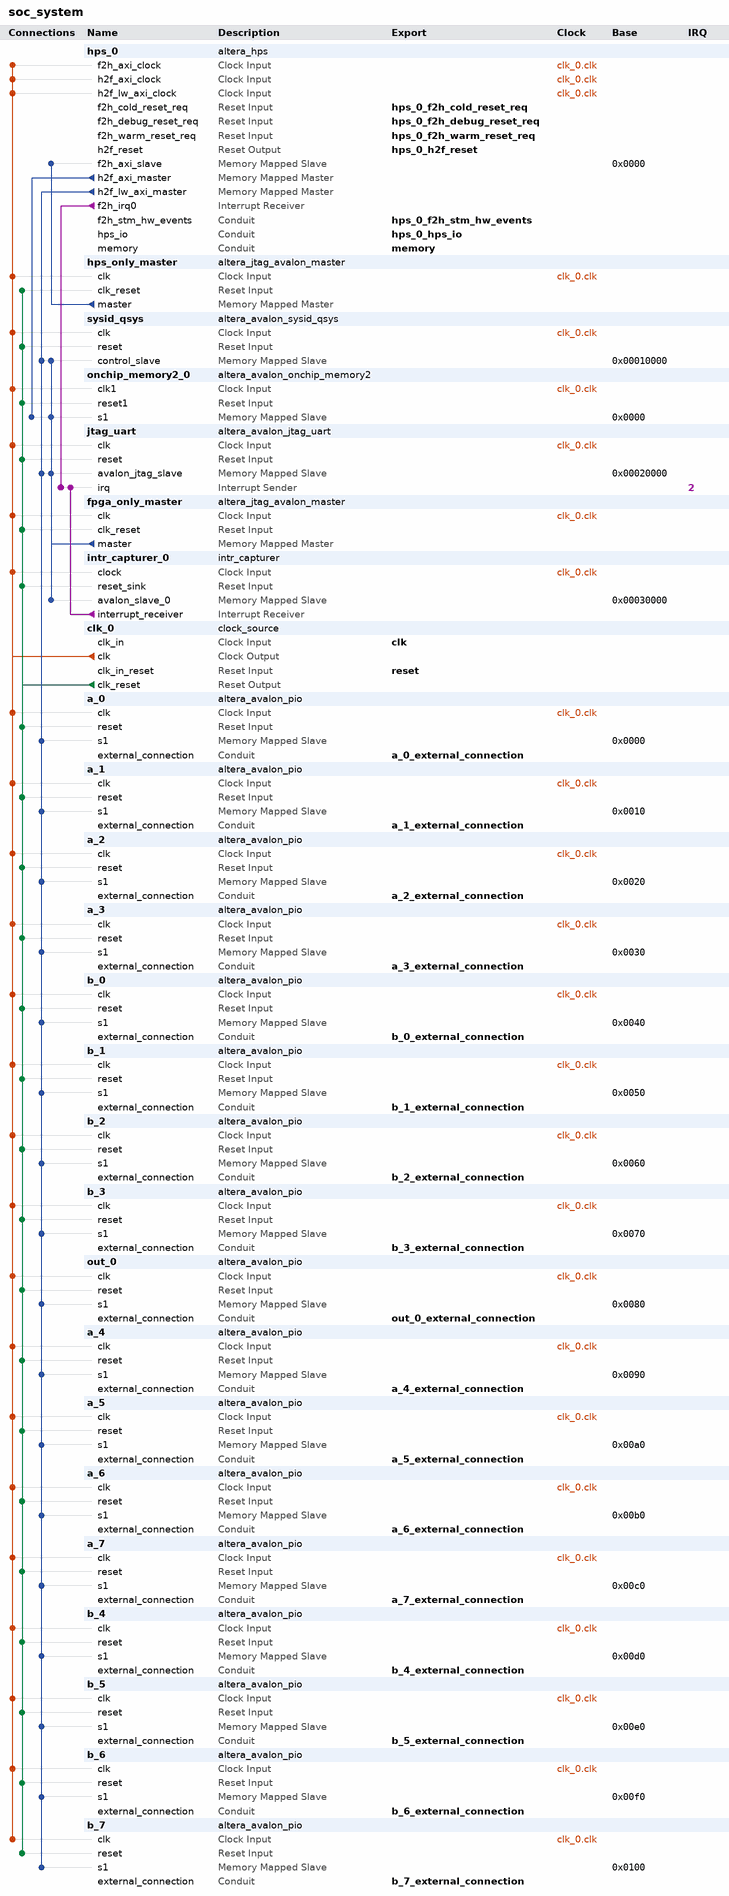
[diagram p0: system contents]
# Platform Designer (Qsys) system soc_system, Cyclone V 5CSEMA5F31C6
# Parameters at their usual value, and those the tool derives, are not listed.
package require -exact qsys 16.1
create_system soc_system
set_project_property DEVICE_FAMILY {Cyclone V}
set_project_property DEVICE 5CSEMA5F31C6

add_instance hps_0 altera_hps 16.1
set_instance_parameter_value hps_0 EMAC1_Mode RGMII
set_instance_parameter_value hps_0 EMAC1_PinMuxing {HPS I/O Set 0}
set_instance_parameter_value hps_0 F2SCLK_COLDRST_Enable true
set_instance_parameter_value hps_0 F2SCLK_DBGRST_Enable true
set_instance_parameter_value hps_0 F2SCLK_WARMRST_Enable true
set_instance_parameter_value hps_0 F2SINTERRUPT_Enable true
set_instance_parameter_value hps_0 F2S_Width 2
set_instance_parameter_value hps_0 FPGA_PERIPHERAL_OUTPUT_CLOCK_FREQ_EMAC0_GTX_CLK 100
set_instance_parameter_value hps_0 FPGA_PERIPHERAL_OUTPUT_CLOCK_FREQ_EMAC0_MD_CLK 100.0
set_instance_parameter_value hps_0 FPGA_PERIPHERAL_OUTPUT_CLOCK_FREQ_EMAC1_GTX_CLK 100
set_instance_parameter_value hps_0 FPGA_PERIPHERAL_OUTPUT_CLOCK_FREQ_EMAC1_MD_CLK 100.0
set_instance_parameter_value hps_0 HPS_PROTOCOL DDR3
set_instance_parameter_value hps_0 I2C0_Mode I2C
set_instance_parameter_value hps_0 I2C0_PinMuxing {HPS I/O Set 0}
set_instance_parameter_value hps_0 I2C1_Mode I2C
set_instance_parameter_value hps_0 I2C1_PinMuxing {HPS I/O Set 0}
set_instance_parameter_value hps_0 LWH2F_Enable true
set_instance_parameter_value hps_0 MEM_BANKADDR_WIDTH 3
set_instance_parameter_value hps_0 MEM_CLK_FREQ 400.0
set_instance_parameter_value hps_0 MEM_COL_ADDR_WIDTH 10
set_instance_parameter_value hps_0 MEM_DQ_WIDTH 32
set_instance_parameter_value hps_0 MEM_DRV_STR RZQ/7
set_instance_parameter_value hps_0 MEM_ROW_ADDR_WIDTH 15
set_instance_parameter_value hps_0 MEM_RTT_NOM RZQ/4
set_instance_parameter_value hps_0 MEM_RTT_WR RZQ/4
set_instance_parameter_value hps_0 MEM_TCL 11
set_instance_parameter_value hps_0 MEM_TFAW_NS 30.0
set_instance_parameter_value hps_0 MEM_TRAS_NS 35.0
set_instance_parameter_value hps_0 MEM_TRCD_NS 13.75
set_instance_parameter_value hps_0 MEM_TRFC_NS 260.0
set_instance_parameter_value hps_0 MEM_TRP_NS 13.75
set_instance_parameter_value hps_0 MEM_VENDOR JEDEC
set_instance_parameter_value hps_0 MEM_WTCL 8
set_instance_parameter_value hps_0 QSPI_Mode {1 SS}
set_instance_parameter_value hps_0 QSPI_PinMuxing {HPS I/O Set 0}
set_instance_parameter_value hps_0 REF_CLK_FREQ 25.0
set_instance_parameter_value hps_0 S2FCLK_USER2CLK 5
set_instance_parameter_value hps_0 S2F_Width 2
set_instance_parameter_value hps_0 SDIO_Mode {4-bit Data}
set_instance_parameter_value hps_0 SDIO_PinMuxing {HPS I/O Set 0}
set_instance_parameter_value hps_0 SPIM1_Mode {Single Slave Select}
set_instance_parameter_value hps_0 SPIM1_PinMuxing {HPS I/O Set 0}
set_instance_parameter_value hps_0 STM_Enable true
set_instance_parameter_value hps_0 TIMING_BOARD_AC_SKEW 0.03
set_instance_parameter_value hps_0 TIMING_BOARD_AC_TO_CK_SKEW 0.0
set_instance_parameter_value hps_0 TIMING_BOARD_DQ_TO_DQS_SKEW 0.0
set_instance_parameter_value hps_0 TIMING_BOARD_MAX_CK_DELAY 0.03
set_instance_parameter_value hps_0 TIMING_BOARD_MAX_DQS_DELAY 0.02
set_instance_parameter_value hps_0 TIMING_BOARD_SKEW_BETWEEN_DQS 0.08
set_instance_parameter_value hps_0 TIMING_BOARD_SKEW_CKDQS_DIMM_MAX 0.16
set_instance_parameter_value hps_0 TIMING_BOARD_SKEW_CKDQS_DIMM_MIN 0.09
set_instance_parameter_value hps_0 TIMING_BOARD_SKEW_WITHIN_DQS 0.01
set_instance_parameter_value hps_0 TIMING_TDH 65
set_instance_parameter_value hps_0 TIMING_TDQSCK 255
set_instance_parameter_value hps_0 TIMING_TDQSQ 125
set_instance_parameter_value hps_0 TIMING_TDS 30
set_instance_parameter_value hps_0 TIMING_TIH 140
set_instance_parameter_value hps_0 TIMING_TIS 180
set_instance_parameter_value hps_0 TIMING_TQSH 0.4
set_instance_parameter_value hps_0 UART0_Mode {No Flow Control}
set_instance_parameter_value hps_0 UART0_PinMuxing {HPS I/O Set 0}
set_instance_parameter_value hps_0 USB1_Mode SDR
set_instance_parameter_value hps_0 USB1_PinMuxing {HPS I/O Set 0}
set_instance_parameter_value hps_0 desired_cfg_clk_mhz 100.0
set_instance_parameter_value hps_0 desired_qspi_clk_mhz 400.0

add_instance hps_only_master altera_jtag_avalon_master 16.1

add_instance sysid_qsys altera_avalon_sysid_qsys 16.1
set_instance_parameter_value sysid_qsys id -1395322110

add_instance onchip_memory2_0 altera_avalon_onchip_memory2 16.1
set_instance_parameter_value onchip_memory2_0 dataWidth 64
set_instance_parameter_value onchip_memory2_0 dualPort false
set_instance_parameter_value onchip_memory2_0 initMemContent true
set_instance_parameter_value onchip_memory2_0 initializationFileName onchip_memory2_0
set_instance_parameter_value onchip_memory2_0 memorySize 65536

add_instance jtag_uart altera_avalon_jtag_uart 16.1
set_instance_parameter_value jtag_uart allowMultipleConnections true
set_instance_parameter_value jtag_uart simInteractiveOptions INTERACTIVE_ASCII_OUTPUT

add_instance fpga_only_master altera_jtag_avalon_master 16.1

add_instance intr_capturer_0 intr_capturer 100.99.98.97

add_instance clk_0 clock_source 16.1
set_instance_parameter_value clk_0 clockFrequency 50000000

add_instance a_0 altera_avalon_pio 16.1
set_instance_parameter_value a_0 direction Output
set_instance_parameter_value a_0 resetValue 255
set_instance_parameter_value a_0 width 8

add_instance a_1 altera_avalon_pio 16.1
set_instance_parameter_value a_1 direction Output
set_instance_parameter_value a_1 resetValue 255
set_instance_parameter_value a_1 width 8

add_instance a_2 altera_avalon_pio 16.1
set_instance_parameter_value a_2 direction Output
set_instance_parameter_value a_2 resetValue 255
set_instance_parameter_value a_2 width 8

add_instance a_3 altera_avalon_pio 16.1
set_instance_parameter_value a_3 direction Output
set_instance_parameter_value a_3 resetValue 255
set_instance_parameter_value a_3 width 8

add_instance b_0 altera_avalon_pio 16.1
set_instance_parameter_value b_0 direction Output
set_instance_parameter_value b_0 resetValue 255
set_instance_parameter_value b_0 width 8

add_instance b_1 altera_avalon_pio 16.1
set_instance_parameter_value b_1 direction Output
set_instance_parameter_value b_1 resetValue 255
set_instance_parameter_value b_1 width 8

add_instance b_2 altera_avalon_pio 16.1
set_instance_parameter_value b_2 direction Output
set_instance_parameter_value b_2 resetValue 255
set_instance_parameter_value b_2 width 8

add_instance b_3 altera_avalon_pio 16.1
set_instance_parameter_value b_3 direction Output
set_instance_parameter_value b_3 resetValue 255
set_instance_parameter_value b_3 width 8

add_instance out_0 altera_avalon_pio 16.1
set_instance_parameter_value out_0 direction Input
set_instance_parameter_value out_0 width 32

add_instance a_4 altera_avalon_pio 16.1
set_instance_parameter_value a_4 direction Output
set_instance_parameter_value a_4 resetValue 255
set_instance_parameter_value a_4 width 8

add_instance a_5 altera_avalon_pio 16.1
set_instance_parameter_value a_5 direction Output
set_instance_parameter_value a_5 resetValue 255
set_instance_parameter_value a_5 width 8

add_instance a_6 altera_avalon_pio 16.1
set_instance_parameter_value a_6 direction Output
set_instance_parameter_value a_6 resetValue 255
set_instance_parameter_value a_6 width 8

add_instance a_7 altera_avalon_pio 16.1
set_instance_parameter_value a_7 direction Output
set_instance_parameter_value a_7 resetValue 255
set_instance_parameter_value a_7 width 8

add_instance b_4 altera_avalon_pio 16.1
set_instance_parameter_value b_4 direction Output
set_instance_parameter_value b_4 resetValue 255
set_instance_parameter_value b_4 width 8

add_instance b_5 altera_avalon_pio 16.1
set_instance_parameter_value b_5 direction Output
set_instance_parameter_value b_5 resetValue 255
set_instance_parameter_value b_5 width 8

add_instance b_6 altera_avalon_pio 16.1
set_instance_parameter_value b_6 direction Output
set_instance_parameter_value b_6 resetValue 255
set_instance_parameter_value b_6 width 8

add_instance b_7 altera_avalon_pio 16.1
set_instance_parameter_value b_7 direction Output
set_instance_parameter_value b_7 resetValue 255
set_instance_parameter_value b_7 width 8

# connections
add_connection clk_0.clk a_0.clk clock
add_connection clk_0.clk a_1.clk clock
add_connection clk_0.clk a_2.clk clock
add_connection clk_0.clk a_3.clk clock
add_connection clk_0.clk a_4.clk clock
add_connection clk_0.clk a_5.clk clock
add_connection clk_0.clk a_6.clk clock
add_connection clk_0.clk a_7.clk clock
add_connection clk_0.clk b_0.clk clock
add_connection clk_0.clk b_1.clk clock
add_connection clk_0.clk b_2.clk clock
add_connection clk_0.clk b_3.clk clock
add_connection clk_0.clk b_4.clk clock
add_connection clk_0.clk b_5.clk clock
add_connection clk_0.clk b_6.clk clock
add_connection clk_0.clk b_7.clk clock
add_connection clk_0.clk fpga_only_master.clk clock
add_connection clk_0.clk hps_0.f2h_axi_clock clock
add_connection clk_0.clk hps_0.h2f_axi_clock clock
add_connection clk_0.clk hps_0.h2f_lw_axi_clock clock
add_connection clk_0.clk hps_only_master.clk clock
add_connection clk_0.clk intr_capturer_0.clock clock
add_connection clk_0.clk jtag_uart.clk clock
add_connection clk_0.clk onchip_memory2_0.clk1 clock
add_connection clk_0.clk out_0.clk clock
add_connection clk_0.clk sysid_qsys.clk clock
add_connection clk_0.clk_reset a_0.reset reset
add_connection clk_0.clk_reset a_1.reset reset
add_connection clk_0.clk_reset a_2.reset reset
add_connection clk_0.clk_reset a_3.reset reset
add_connection clk_0.clk_reset a_4.reset reset
add_connection clk_0.clk_reset a_5.reset reset
add_connection clk_0.clk_reset a_6.reset reset
add_connection clk_0.clk_reset a_7.reset reset
add_connection clk_0.clk_reset b_0.reset reset
add_connection clk_0.clk_reset b_1.reset reset
add_connection clk_0.clk_reset b_2.reset reset
add_connection clk_0.clk_reset b_3.reset reset
add_connection clk_0.clk_reset b_4.reset reset
add_connection clk_0.clk_reset b_5.reset reset
add_connection clk_0.clk_reset b_6.reset reset
add_connection clk_0.clk_reset b_7.reset reset
add_connection clk_0.clk_reset fpga_only_master.clk_reset reset
add_connection clk_0.clk_reset hps_only_master.clk_reset reset
add_connection clk_0.clk_reset intr_capturer_0.reset_sink reset
add_connection clk_0.clk_reset jtag_uart.reset reset
add_connection clk_0.clk_reset onchip_memory2_0.reset1 reset
add_connection clk_0.clk_reset out_0.reset reset
add_connection clk_0.clk_reset sysid_qsys.reset reset
add_connection fpga_only_master.master intr_capturer_0.avalon_slave_0 avalon
set_connection_parameter_value fpga_only_master.master/intr_capturer_0.avalon_slave_0 baseAddress 0x00030000
add_connection fpga_only_master.master jtag_uart.avalon_jtag_slave avalon
set_connection_parameter_value fpga_only_master.master/jtag_uart.avalon_jtag_slave baseAddress 0x00020000
add_connection fpga_only_master.master onchip_memory2_0.s1 avalon
set_connection_parameter_value fpga_only_master.master/onchip_memory2_0.s1 baseAddress 0x0000
add_connection fpga_only_master.master sysid_qsys.control_slave avalon
set_connection_parameter_value fpga_only_master.master/sysid_qsys.control_slave baseAddress 0x00010000
add_connection hps_0.h2f_axi_master onchip_memory2_0.s1 avalon
set_connection_parameter_value hps_0.h2f_axi_master/onchip_memory2_0.s1 baseAddress 0x0000
add_connection hps_0.h2f_lw_axi_master a_0.s1 avalon
set_connection_parameter_value hps_0.h2f_lw_axi_master/a_0.s1 baseAddress 0x0000
add_connection hps_0.h2f_lw_axi_master a_1.s1 avalon
set_connection_parameter_value hps_0.h2f_lw_axi_master/a_1.s1 baseAddress 0x0010
add_connection hps_0.h2f_lw_axi_master a_2.s1 avalon
set_connection_parameter_value hps_0.h2f_lw_axi_master/a_2.s1 baseAddress 0x0020
add_connection hps_0.h2f_lw_axi_master a_3.s1 avalon
set_connection_parameter_value hps_0.h2f_lw_axi_master/a_3.s1 baseAddress 0x0030
add_connection hps_0.h2f_lw_axi_master a_4.s1 avalon
set_connection_parameter_value hps_0.h2f_lw_axi_master/a_4.s1 baseAddress 0x0090
add_connection hps_0.h2f_lw_axi_master a_5.s1 avalon
set_connection_parameter_value hps_0.h2f_lw_axi_master/a_5.s1 baseAddress 0x00a0
add_connection hps_0.h2f_lw_axi_master a_6.s1 avalon
set_connection_parameter_value hps_0.h2f_lw_axi_master/a_6.s1 baseAddress 0x00b0
add_connection hps_0.h2f_lw_axi_master a_7.s1 avalon
set_connection_parameter_value hps_0.h2f_lw_axi_master/a_7.s1 baseAddress 0x00c0
add_connection hps_0.h2f_lw_axi_master b_0.s1 avalon
set_connection_parameter_value hps_0.h2f_lw_axi_master/b_0.s1 baseAddress 0x0040
add_connection hps_0.h2f_lw_axi_master b_1.s1 avalon
set_connection_parameter_value hps_0.h2f_lw_axi_master/b_1.s1 baseAddress 0x0050
add_connection hps_0.h2f_lw_axi_master b_2.s1 avalon
set_connection_parameter_value hps_0.h2f_lw_axi_master/b_2.s1 baseAddress 0x0060
add_connection hps_0.h2f_lw_axi_master b_3.s1 avalon
set_connection_parameter_value hps_0.h2f_lw_axi_master/b_3.s1 baseAddress 0x0070
add_connection hps_0.h2f_lw_axi_master b_4.s1 avalon
set_connection_parameter_value hps_0.h2f_lw_axi_master/b_4.s1 baseAddress 0x00d0
add_connection hps_0.h2f_lw_axi_master b_5.s1 avalon
set_connection_parameter_value hps_0.h2f_lw_axi_master/b_5.s1 baseAddress 0x00e0
add_connection hps_0.h2f_lw_axi_master b_6.s1 avalon
set_connection_parameter_value hps_0.h2f_lw_axi_master/b_6.s1 baseAddress 0x00f0
add_connection hps_0.h2f_lw_axi_master b_7.s1 avalon
set_connection_parameter_value hps_0.h2f_lw_axi_master/b_7.s1 baseAddress 0x0100
add_connection hps_0.h2f_lw_axi_master jtag_uart.avalon_jtag_slave avalon
set_connection_parameter_value hps_0.h2f_lw_axi_master/jtag_uart.avalon_jtag_slave baseAddress 0x00020000
add_connection hps_0.h2f_lw_axi_master out_0.s1 avalon
set_connection_parameter_value hps_0.h2f_lw_axi_master/out_0.s1 baseAddress 0x0080
add_connection hps_0.h2f_lw_axi_master sysid_qsys.control_slave avalon
set_connection_parameter_value hps_0.h2f_lw_axi_master/sysid_qsys.control_slave baseAddress 0x00010000
add_connection hps_only_master.master hps_0.f2h_axi_slave avalon
set_connection_parameter_value hps_only_master.master/hps_0.f2h_axi_slave baseAddress 0x0000
add_connection hps_0.f2h_irq0 jtag_uart.irq interrupt
set_connection_parameter_value hps_0.f2h_irq0/jtag_uart.irq irqNumber 2
add_connection intr_capturer_0.interrupt_receiver jtag_uart.irq interrupt
set_connection_parameter_value intr_capturer_0.interrupt_receiver/jtag_uart.irq irqNumber 2

# exported interfaces
add_interface a_0_external_connection conduit end
set_interface_property a_0_external_connection EXPORT_OF a_0.external_connection
add_interface a_1_external_connection conduit end
set_interface_property a_1_external_connection EXPORT_OF a_1.external_connection
add_interface a_2_external_connection conduit end
set_interface_property a_2_external_connection EXPORT_OF a_2.external_connection
add_interface a_3_external_connection conduit end
set_interface_property a_3_external_connection EXPORT_OF a_3.external_connection
add_interface a_4_external_connection conduit end
set_interface_property a_4_external_connection EXPORT_OF a_4.external_connection
add_interface a_5_external_connection conduit end
set_interface_property a_5_external_connection EXPORT_OF a_5.external_connection
add_interface a_6_external_connection conduit end
set_interface_property a_6_external_connection EXPORT_OF a_6.external_connection
add_interface a_7_external_connection conduit end
set_interface_property a_7_external_connection EXPORT_OF a_7.external_connection
add_interface b_0_external_connection conduit end
set_interface_property b_0_external_connection EXPORT_OF b_0.external_connection
add_interface b_1_external_connection conduit end
set_interface_property b_1_external_connection EXPORT_OF b_1.external_connection
add_interface b_2_external_connection conduit end
set_interface_property b_2_external_connection EXPORT_OF b_2.external_connection
add_interface b_3_external_connection conduit end
set_interface_property b_3_external_connection EXPORT_OF b_3.external_connection
add_interface b_4_external_connection conduit end
set_interface_property b_4_external_connection EXPORT_OF b_4.external_connection
add_interface b_5_external_connection conduit end
set_interface_property b_5_external_connection EXPORT_OF b_5.external_connection
add_interface b_6_external_connection conduit end
set_interface_property b_6_external_connection EXPORT_OF b_6.external_connection
add_interface b_7_external_connection conduit end
set_interface_property b_7_external_connection EXPORT_OF b_7.external_connection
add_interface clk clock sink
set_interface_property clk EXPORT_OF clk_0.clk_in
add_interface hps_0_f2h_cold_reset_req reset sink
set_interface_property hps_0_f2h_cold_reset_req EXPORT_OF hps_0.f2h_cold_reset_req
add_interface hps_0_f2h_debug_reset_req reset sink
set_interface_property hps_0_f2h_debug_reset_req EXPORT_OF hps_0.f2h_debug_reset_req
add_interface hps_0_f2h_stm_hw_events conduit end
set_interface_property hps_0_f2h_stm_hw_events EXPORT_OF hps_0.f2h_stm_hw_events
add_interface hps_0_f2h_warm_reset_req reset sink
set_interface_property hps_0_f2h_warm_reset_req EXPORT_OF hps_0.f2h_warm_reset_req
add_interface hps_0_h2f_reset reset source
set_interface_property hps_0_h2f_reset EXPORT_OF hps_0.h2f_reset
add_interface hps_0_hps_io conduit end
set_interface_property hps_0_hps_io EXPORT_OF hps_0.hps_io
add_interface memory conduit end
set_interface_property memory EXPORT_OF hps_0.memory
add_interface out_0_external_connection conduit end
set_interface_property out_0_external_connection EXPORT_OF out_0.external_connection
add_interface reset reset sink
set_interface_property reset EXPORT_OF clk_0.clk_in_reset

set_interconnect_requirement {$system} qsys_mm.clockCrossingAdapter HANDSHAKE
set_interconnect_requirement {$system} qsys_mm.maxAdditionalLatency 1

save_system soc_system.qsys
